# Altium schematic sheet Relays.SchDoc
size A
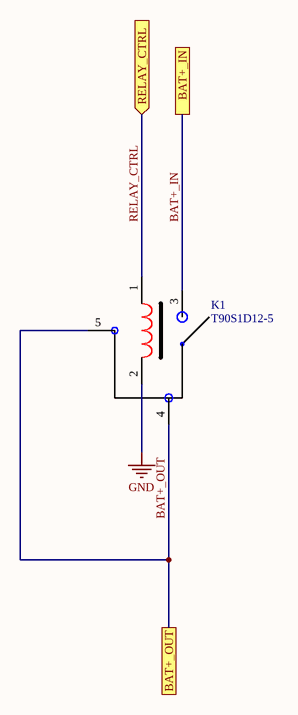
[diagram p0: Relays.SchDoc]

## Parts
K1  T90S1D12-5  [T90S]

## Ports
BAT+_IN, BAT+_OUT, RELAY_CTRL (in)

## Nets
GND: K1.2(Coil)
BAT+_IN: K1.3(Contact) ; port BAT+_IN
BAT+_OUT: K1.4(Contact) K1.5(Contact) ; port BAT+_OUT
RELAY_CTRL: K1.1(Coil) ; port RELAY_CTRL

## Library data of the parts
K1 = T90S1D12-5: General Purpose Relays SPST-NO PCB 5 VDC; Manufacturer: TE Connectivity; Coil Power: 1W; Power Consumption: 2.8W; Coil Current: 185mA; Current Rating: 30A; Voltage Rating (DC): 5V; Release Time: 15ms; Throw Configuration: SPST; Max Voltage Rating (AC): 277V; Coil Resistance: 27R; Coil Type: Non-Latching; Voltage Rating (AC): 240V; Supplier 1: Mouser; Contact Material: Silver,Cadmium; Manufacturer Part Number: T90S1D12-5; Height: 20.4mm; Depth: 25.9mm; Length: 32.3mm; Weight: 0.918oz; Operate Time: 15ms; Coil Voltage (DC): 5V; Width: 27.4mm; Contact Voltage Rating (AC): 277V; Number of Pins: 5; Max Operating Temperature: 85°C; Min Operating Temperature: -55°C; Mount: Through Hole,PCB; Contact Current Rating: 30A; ComponentLink1URL: https://datasheet.ciiva.com/2406/eng-ds-1308242-t90-0214-t90-2406880.pdf; ComponentLink1Description: https://datasheet.ciiva.com/2406/eng-ds-1308242-t90-0214-t90-2406880.pdf; ComponentLink2URL: https://datasheet.ciiva.com/30468/0900766b8107bb2d-30468875.pdf; ComponentLink2Description: https://datasheet.ciiva.com/30468/0900766b8107bb2d-30468875.pdf; ComponentLink3URL: https://datasheet.ciiva.com/7999/1470339-7999710.pdf; ComponentLink3Description: https://datasheet.ciiva.com/7999/1470339-7999710.pdf; Supplier Part Number 1: 655-T90S1D12-5